# EAGLE design micro (EAGLE 6.5.0)
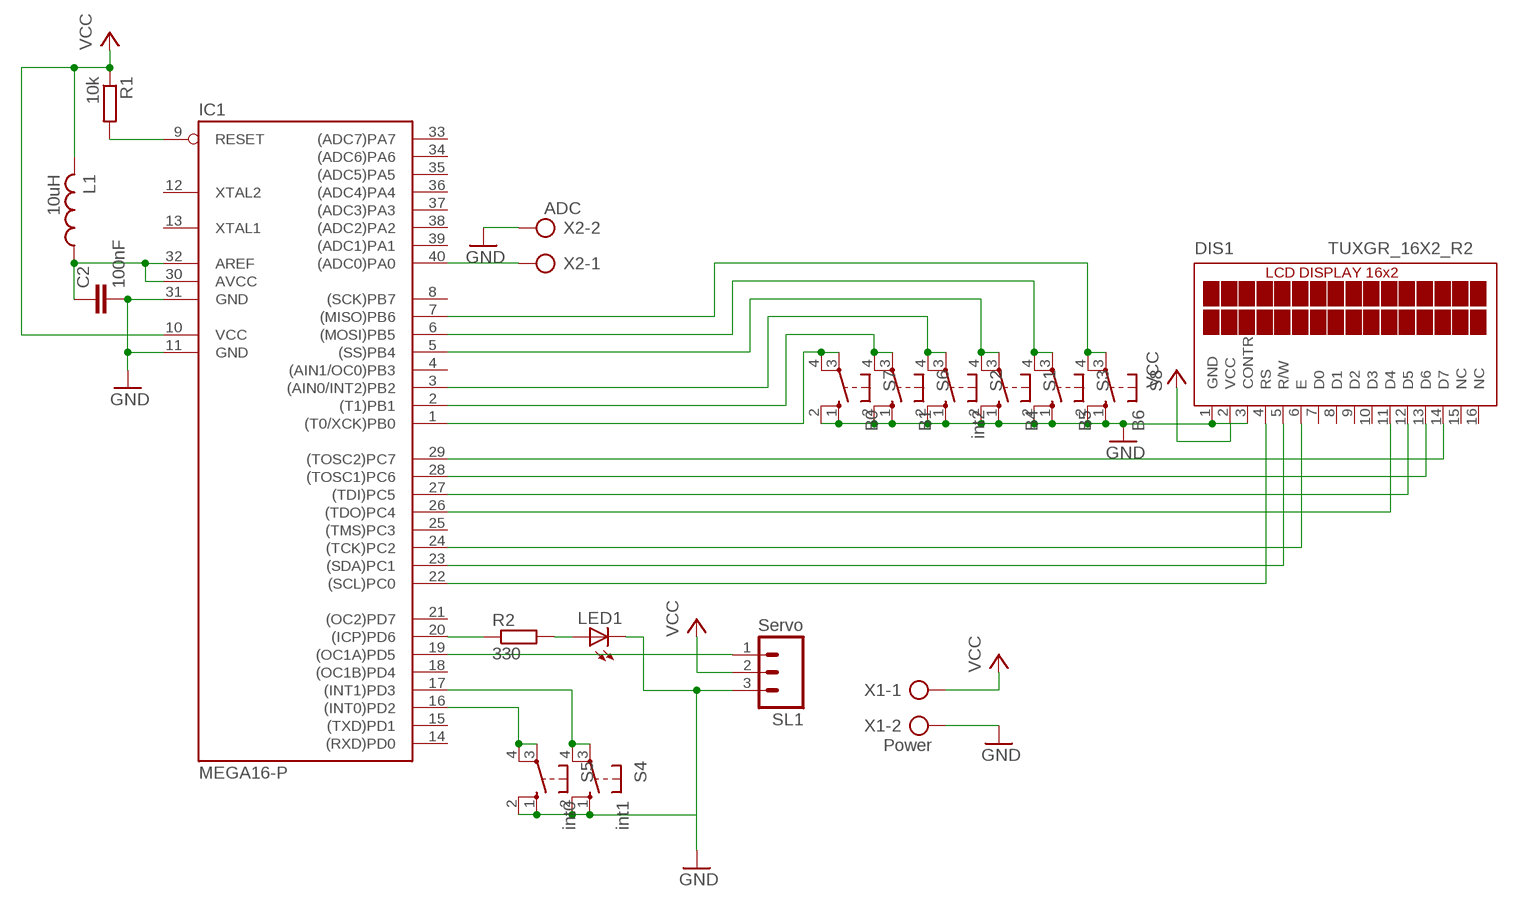
[diagram p0: schematic, sheet 1]

## Parts
C2  100nF  C-EU025-024X044  [C025-024X044]
DIS1  TUXGR_16X2_R2  [TUXGR_16X2_R2]
IC1  MEGA16-P  [DIL40]
L1  10uH  L-US0204/5  [0204/5]
LED1  LED5MM  [LED5MM]
R1  10k  R-EU_0204/7  [0204/7]
R2  330  R-EU_0204/7  [0204/7]
S1  B4  10-XX  [B3F-10XX]
S2  int2  10-XX  [B3F-10XX]
S3  B5  10-XX  [B3F-10XX]
S4  int1  10-XX  [B3F-10XX]
S5  int0  10-XX  [B3F-10XX]
S6  B1  10-XX  [B3F-10XX]
S7  B0  10-XX  [B3F-10XX]
S8  B6  10-XX  [B3F-10XX]
SL1  Servo  M03  [03P]
X1  Power  AK300/2  [AK300/2]
X2  ADC  AK300/2  [AK300/2]

## Nets
GND: C2.2 DIS1.1(GND) DIS1.3(CONTR) IC1.11(GND) IC1.31(GND) LED1.K(C) S1.1(S) S1.2(S1) S2.1(S) S2.2(S1) S3.1(S) S3.2(S1) S4.1(S) S4.2(S1) S5.1(S) S5.2(S1) S6.1(S) S6.2(S1) S7.1(S) S7.2(S1) S8.1(S) S8.2(S1) SL1.3 X1.2 X2.2
N$1: DIS1.4(RS) IC1.22((SCL)PC0)
N$2: DIS1.5(R/W) IC1.23((SDA)PC1)
N$3: DIS1.6(E) IC1.24((TCK)PC2)
N$4: DIS1.11(D4) IC1.26((TDO)PC4)
N$5: DIS1.12(D5) IC1.27((TDI)PC5)
N$6: DIS1.13(D6) IC1.28((TOSC1)PC6)
N$7: DIS1.14(D7) IC1.29((TOSC2)PC7)
N$8: IC1.1((T0/XCK)PB0) S7.3(P) S7.4(P1)
N$9: IC1.40((ADC0)PA0) X2.1
N$10: IC1.19((OC1A)PD5) SL1.1
N$11: IC1.2((T1)PB1) S6.3(P) S6.4(P1)
N$12: IC1.3((AIN0/INT2)PB2) S2.3(P) S2.4(P1)
N$13: IC1.5((SS)PB4) S1.3(P) S1.4(P1)
N$14: IC1.6((MOSI)PB5) S3.3(P) S3.4(P1)
N$15: IC1.7((MISO)PB6) S8.3(P) S8.4(P1)
N$16: IC1.16((INT0)PD2) S5.3(P) S5.4(P1)
N$17: IC1.17((INT1)PD3) S4.3(P) S4.4(P1)
N$18: IC1.20((ICP)PD6) R2.1
N$19: LED1.A R2.2
N$20: IC1.9(RESET) R1.2
N$23: C2.1 IC1.30(AVCC) IC1.32(AREF) L1.1
VCC: DIS1.2(VCC) IC1.10(VCC) L1.2 R1.1 SL1.2 X1.1
Unconnected: DIS1.7(D0) DIS1.8(D1) DIS1.9(D2) DIS1.10(D3) DIS1.15(NC) DIS1.16(NC) IC1.4((AIN1/OC0)PB3) IC1.8((SCK)PB7) IC1.12(XTAL2) IC1.13(XTAL1) IC1.14((RXD)PD0) IC1.15((TXD)PD1) IC1.18((OC1B)PD4) IC1.21((OC2)PD7) IC1.25((TMS)PC3) IC1.33((ADC7)PA7) IC1.34((ADC6)PA6) IC1.35((ADC5)PA5) IC1.36((ADC4)PA4) IC1.37((ADC3)PA3) IC1.38((ADC2)PA2) IC1.39((ADC1)PA1)

## Library data of the parts
C2 = Mohammad Waleed:C-EU: CAPACITOR, European symbol
DIS1 = display-lcd:TUXGR_16X2_R2: Tuxgraphics LCD display 16x2 characters reflective, without background light Source: tuxgr_12x2_r2.pdf; OC_FARNELL: unknown; OC_NEWARK: unknown
IC1 = atmel:MEGA16-P: MICROCONTROLLER 16 Kbytes FLASH 1 kbytes SRAM 512 bytes EEPROM USART 8-channel 10 bit ADC Source: avr.lbr; MPN: ATMEGA16-16PU; OC_FARNELL: 9171142; OC_NEWARK: 01M6885
L1 = rcl:L-US: INDUCTOR, American symbol
LED1 = Mohammad Waleed:LED: LED OSRAM: - CHIPLED LG R971, LG N971, LY N971, LG Q971, LY Q971, LO R971, LY R971 LH N974, LH R974 LS Q976, LO Q976, LY Q976 LO Q996 - Hyper CHIPLED LW Q18S LB Q993, LB Q99A, LB R99A - SideLED LS A670, LO A670, LY A670, LG A670, LP A670 LB A673, LV A673, LT A673, LW A673 LH A674 LY A675 LS A676, LA A676, LO A676, LY A676, LW A676 LS A679, LY A679, LG A679 - Hyper Micro SIDELED® LS Y876, LA Y876, LO Y876, LY Y876 LT Y87S - SmartLED LW L88C, LW L88S LB L89C, LB L89S, LG L890 LS L89K, LO L89K, LY L89K LS L896, LA L896, LO L896, LY L896 - TOPLED LS T670, LO T670, LY T670, LG T670, LP T670 LSG T670, LSP T670, LSY T670, LOP T670, LYG T670 LG T671, LOG T671, LSG T671 LB T673, LV T673, LT T673, LW T673 LH T674 LS T676, LA T676, LO T676, LY T676, LB T676, LH T676, LSB T676, LW T676 LB T67C, LV T67C, LT T67C, LS T67K, LO T67K, LY T67K, LW E67C LS E67B, LA E67B, LO E67B, LY E67B, LB E67C, LV E67C, LT E67C LW T67C LS T679, LY T679, LG T679 LS T770, LO T770, LY T770, LG T770, LP T770 LB T773, LV T773, LT T773, LW T773 LH T774 LS E675, LA E675, LY E675, LS T675 LS T776, LA T776, LO T776, LY T776, LB T776 LHGB T686 LT T68C, LB T68C - Hyper Mini TOPLED® LB M676 - Mini TOPLED Santana® LG M470 LS M47K, LO M47K, LY M47K Source: http://www.osram.convergy.de LUXEON: - LUMILED® LXK2-PW12-R00, LXK2-PW12-S00, LXK2-PW14-U00, LXK2-PW14-V00 LXK2-PM12-R00, LXK2-PM12-S00, LXK2-PM14-U00 LXK2-PE12-Q00, LXK2-PE12-R00, LXK2-PE12-S00, LXK2-PE14-T00, LXK2-PE14-U00 LXK2-PB12-K00, LXK2-PB12-L00, LXK2-PB12-M00, LXK2-PB14-N00, LXK2-PB14-P00, LXK2-PB14-Q00 LXK2-PR12-L00, LXK2-PR12-M00, LXK2-PR14-Q00, LXK2-PR14-R00 LXK2-PD12-Q00, LXK2-PD12-R00, LXK2-PD12-S00 LXK2-PH12-R00, LXK2-PH12-S00 LXK2-PL12-P00, LXK2-PL12-Q00, LXK2-PL12-R00 Source: www.luxeon.com KINGBRIGHT: KA-3528ASYC Source: www.kingbright.com
R1 R2 = Mohammad Waleed:R-EU_: RESISTOR, European symbol
S1-S8 = Mohammad Waleed:10-XX: OMRON SWITCH; MPN: B3F-1000; OC_FARNELL: 176432; OC_NEWARK: 36M3542
SL1 = con-amp-quick:M03: AMP QUICK CONNECTOR; OC_FARNELL: unknown; OC_NEWARK: unknown
X1 X2 = Mohammad Waleed:AK300/2: CONNECTOR; OC_FARNELL: unknown; OC_NEWARK: unknown

## Board
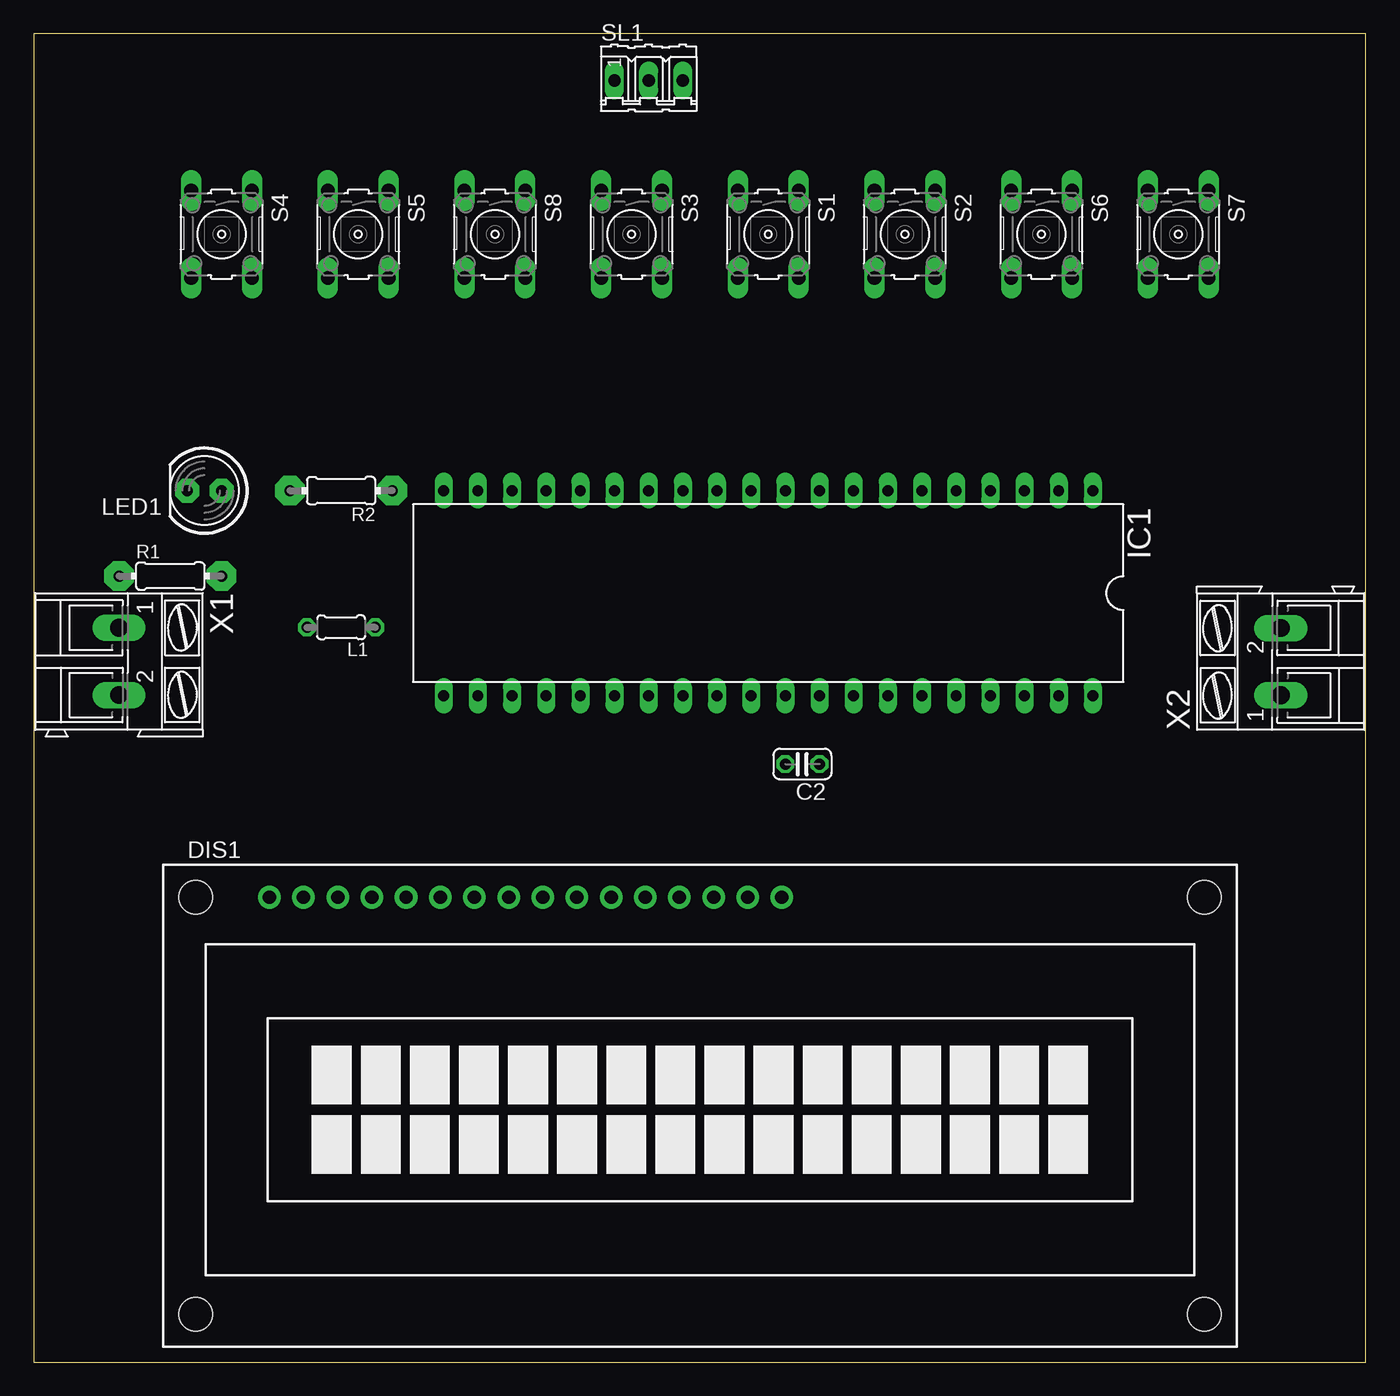
[diagram p1: board, top side]
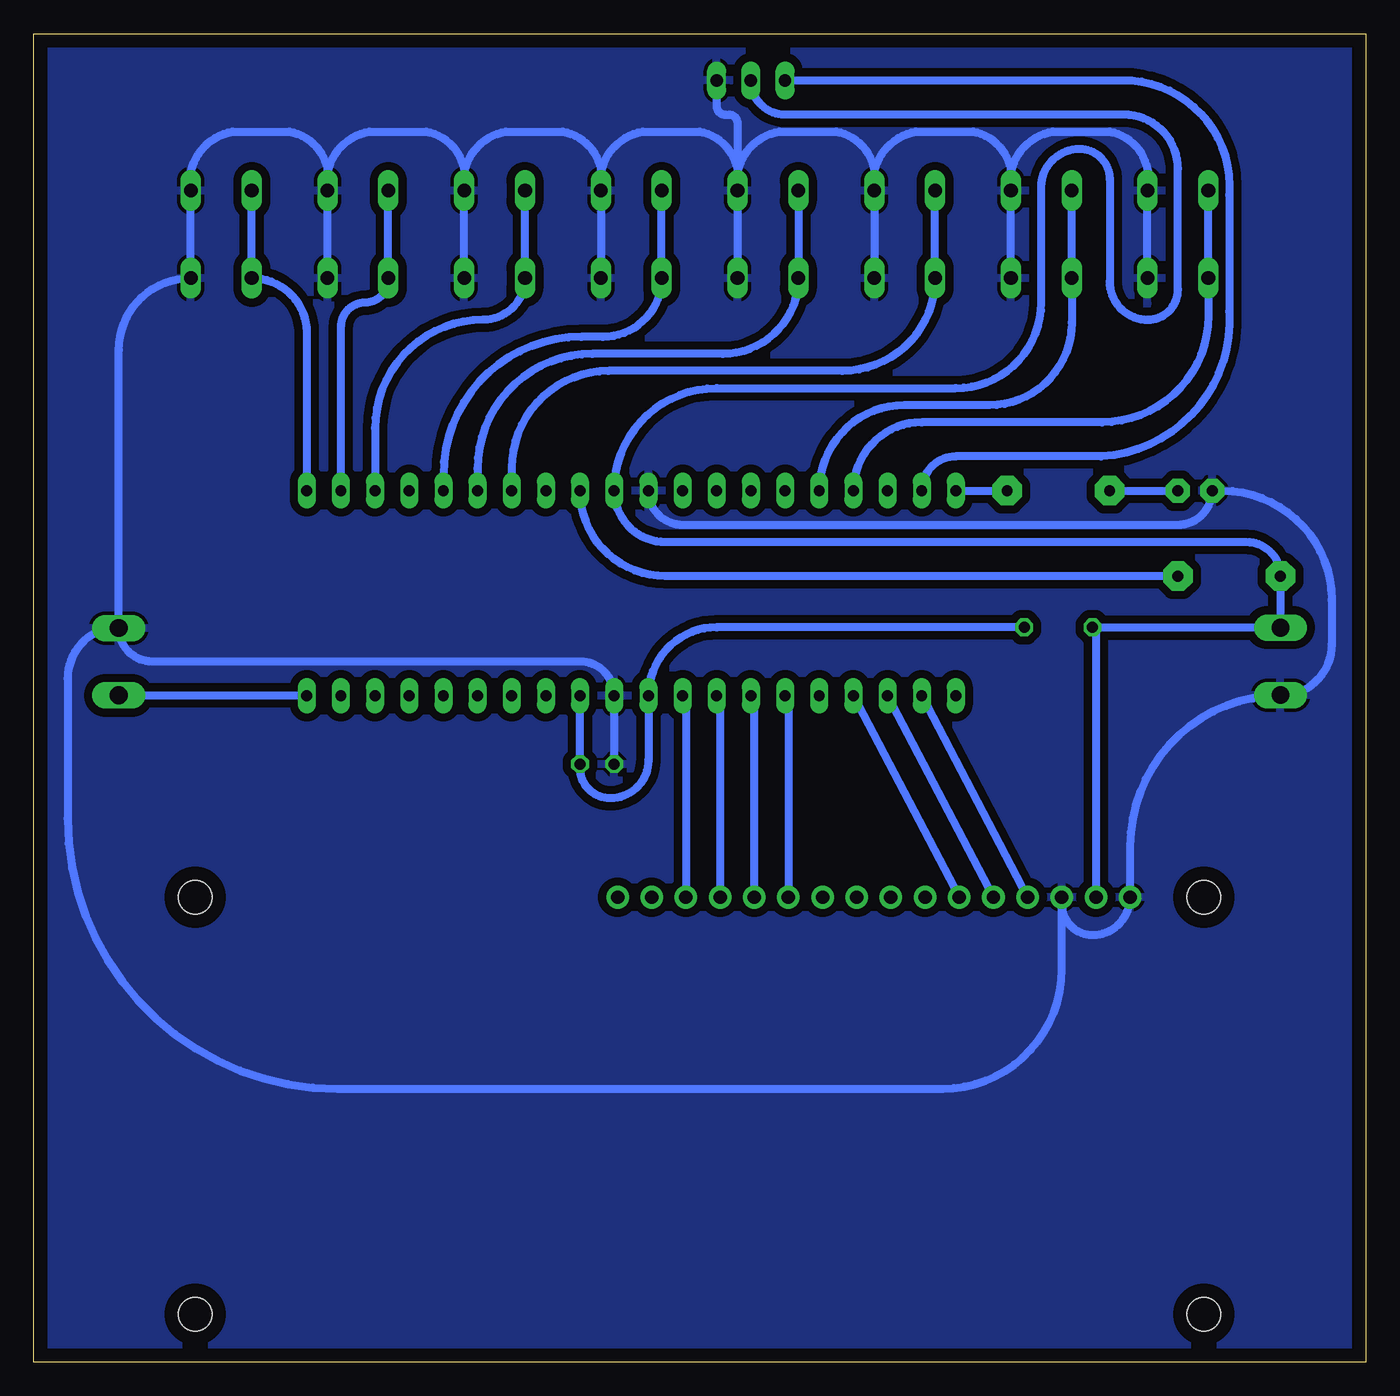
[diagram p2: board, bottom side, seen from below]

Size 99.04 x 98.73 mm. Coordinates in mm from the lower left corner, seen from the top.
Outline: 0,0 99.04,0 99.04,98.73 0,98.73 0,0
Copper layers (1*16): Top 0.035mm / dielectric 1.5mm / Bottom 0.035mm
Design rules "mws!": minimum track width 16mil, minimum drill 23mil, track to track 16mil, track to pad 16mil, pad to pad 16mil, via to via 16mil, smd to smd 8mil, copper to edge 40mil, drill to drill 8mil, minimum pad ring 10mil, minimum via ring 8mil, stop-mask expansion 4mil, vias tented up to drill 0mil, thermal gap 10mil

### Footprints (pad centres in the part's own frame; a part is rotated, then mirrored left to right if it is on the bottom)
C025-024X044 = drill 0.813 octagon: 1 -1.27,0; 2 1.27,0
TUXGR_16X2_R2 = drill 1 pad 1.676: 1 -32,15.5; 2 -29.46,15.5; 3 -26.92,15.5; 4 -24.38,15.5; 5 -21.84,15.5; 6 -19.3,15.5; 7 -16.76,15.5; 8 -14.22,15.5; 9 -11.68,15.5; 10 -9.14,15.5; 11 -6.6,15.5; 12 -4.06,15.5; 13 -1.52,15.5; 14 1.02,15.5; 15 3.56,15.5; 16 6.1,15.5 | hole 2.5: -37.5,-15.5; 37.5,-15.5; -37.5,15.5; 37.5,15.5
DIL40 = drill 0.813 long: 1 -24.13,-7.62; 2 -21.59,-7.62; 3 -19.05,-7.62; 4 -16.51,-7.62; 5 -13.97,-7.62; 6 -11.43,-7.62; 7 -8.89,-7.62; 8 -6.35,-7.62; 9 -3.81,-7.62; 10 -1.27,-7.62; 11 1.27,-7.62; 12 3.81,-7.62; 13 6.35,-7.62; 14 8.89,-7.62; 15 11.43,-7.62; 16 13.97,-7.62; 17 16.51,-7.62; 18 19.05,-7.62; 19 21.59,-7.62; 20 24.13,-7.62; 21 24.13,7.62; 22 21.59,7.62; 23 19.05,7.62; 24 16.51,7.62; 25 13.97,7.62; 26 11.43,7.62; 27 8.89,7.62; 28 6.35,7.62; 29 3.81,7.62; 30 1.27,7.62; 31 -1.27,7.62; 32 -3.81,7.62; 33 -6.35,7.62; 34 -8.89,7.62; 35 -11.43,7.62; 36 -13.97,7.62; 37 -16.51,7.62; 38 -19.05,7.62; 39 -21.59,7.62; 40 -24.13,7.62
0204/5 = drill 0.813 octagon: 1 -2.54,0; 2 2.54,0
LED5MM = drill 0.813 pad 1.778 octagon: A -1.27,0; K 1.27,0
0204/7 = drill 0.813 pad 2.184 octagon: 1 -3.81,0; 2 3.81,0
B3F-10XX = drill 1.016 long: 1 -3.251,2.261; 2 3.251,2.261; 3 -3.251,-2.261; 4 3.251,-2.261
03P = drill 0.914 long: 1 -2.54,0; 2 0,0; 3 2.54,0
AK300/2 = drill 1.321 long: 1 -2.515,0; 2 2.489,0

### Placement (x,y rotation side)
C2  57.15,44.45 180 top
DIS1  49.53,19.05 0 top
IC1  54.61,57.15 180 top
L1  22.86,54.61 180 top
LED1  12.7,64.77 180 top
R1  10.16,58.42 0 top
R2  22.86,64.77 180 top
S1  54.61,83.82 270 top
S2  64.77,83.82 270 top
S3  44.45,83.82 270 top
S4  13.97,83.82 270 top
S5  24.13,83.82 270 top
S6  74.93,83.82 270 top
S7  85.09,83.82 270 top
S8  34.29,83.82 270 top
SL1  45.72,95.25 0 top
X1  6.35,52.07 270 top
X2  92.71,52.07 90 top

### Tracks (layer width: path | path; a pad name or v marks a point on that pad's centre or on a via)
GND
  Bottom 0.61: 6.35,49.53 arc-90 2.54,53.34 2.54,56.64 arc-90 10.67,64.77 LED1.K arc90 13.97,62.23 50.8,62.23 arc90 IC1.11 | 6.35,49.53 X1.2 | S8.1 S8.2 | S3.1 S3.2 | S1.1 S1.2 | S6.2 S6.1 | S2.2 S2.1 | S4.2 S4.1 16.23,87.35 arc-90 19.05,91.44 23.29,91.44 arc-90 S5.1 | S5.2 S5.1 | X2.2 92.71,75.21 arc90 S7.2 S7.1 arc90 84.25,91.44 80.01,91.44 arc90 77.19,87.35 S6.1 | S6.1 arc90 74.09,91.44 69.85,91.44 arc90 67.03,87.35 S2.1 | S2.1 arc90 63.93,91.44 59.69,91.44 arc90 56.87,87.35 S1.1 | S1.1 arc90 53.77,91.44 49.53,91.44 arc90 46.71,87.35 S3.1 | S3.1 arc90 43.61,91.44 39.37,91.44 arc90 36.55,87.35 S8.1 | S8.1 arc90 33.45,91.44 29.21,91.44 arc90 26.39,87.35 S5.1 | X2.2 arc-90 90.22,52.07 58.42,52.07 arc90 IC1.31 C2.2 | SL1.3 48.26,93.34 arc-90 47.62,92.71 47.35,92.71 arc90 46.71,92.08 S3.1 | 17.53,34.27 DIS1.1 | X2.2 92.71,54.61 arc-90 96.52,50.8 96.52,40.4 arc-90 76.44,20.32 31.48,20.32 arc-90 22.61,29.19 DIS1.3 22.61,34.04 arc-90 20.32,31.75 arc-90 DIS1.1 | 6.35,49.53 arc-90 17.53,38.35 DIS1.1
  pour Bottom (isolate 0.61): -11.43,105.41 109.22,105.41 109.22,-10.16 -11.43,-10.16
N$1
  Bottom 0.61: IC1.22 DIS1.4
N$2
  Bottom 0.61: IC1.23 DIS1.5
N$3
  Bottom 0.61: IC1.24 DIS1.6
N$4
  Bottom 0.61: IC1.26 arc90 42.93,49.28 DIS1.11
N$5
  Bottom 0.61: IC1.27 arc90 45.47,49.28 DIS1.12
N$6
  Bottom 0.61: IC1.28 arc90 48.01,49.28 DIS1.13
N$7
  Bottom 0.61: IC1.29 arc90 50.55,49.28 DIS1.14
N$8
  Bottom 0.61: S7.3 S7.4 arc90 78.74,76.48 IC1.1
N$9
  Bottom 0.61: X2.1 78.74,49.55 IC1.40
N$10
  Bottom 0.61: SL1.1 17.41,95.25 arc90 10.16,86.73 10.16,78.09 arc90 19.67,67.31 30.48,67.31 arc-90 IC1.19
N$11
  Bottom 0.61: S6.3 S6.4 72.67,80.47 arc90 74.4,78.74 arc-90 76.2,76.94 IC1.2
N$12
  Bottom 0.61: S2.3 S2.4 arc90 65.61,77.47 arc-90 73.66,69.42 IC1.3
N$13
  Bottom 0.61: S1.3 S1.4 arc90 56.72,76.2 58.34,76.2 arc-90 68.58,65.96 IC1.5
N$14
  Bottom 0.61: S3.3 S3.4 arc90 47.83,74.93 57.52,74.93 arc-90 66.04,66.41 IC1.6
N$15
  Bottom 0.61: S8.3 S8.4 arc90 38.94,73.66 56.32,73.66 arc-90 63.5,66.48 IC1.7
N$16
  Bottom 0.61: S5.3 S5.4 21.87,77.25 arc90 28,71.12 34.29,71.12 arc-90 IC1.16
N$17
  Bottom 0.61: S4.3 S4.4 11.71,77.77 arc90 19.62,69.85 33.02,69.85 arc-90 IC1.17
N$18
  Bottom 0.61: IC1.20 R2.1
N$19
  Bottom 0.61: R2.2 LED1.A
N$20
  Bottom 0.61: R1.2 52.07,58.42 arc90 IC1.9
N$23
  Bottom 0.61: L1.1 48.26,54.61 arc-90 IC1.30 53.34,44.75 arc90 56.18,41.91 arc90 58.42,44.15 C2.1 IC1.32
VCC
  Bottom 0.61: 20.07,54.59 X1.1 R1.1 arc-90 8.89,60.96 52.07,60.96 arc90 IC1.10 arc90 48.26,72.39 30.48,72.39 arc-90 24.13,78.74 24.13,87.33 arc90 21.29,90.17 arc90 19.05,87.93 19.05,80.31 arc-90 16.21,77.47 arc-90 13.97,79.71 13.97,88.69 arc-90 17.99,92.71 43.18,92.71 arc90 SL1.2 | L1.2 20.32,54.59 20.07,54.59 | 20.07,54.59 DIS1.2